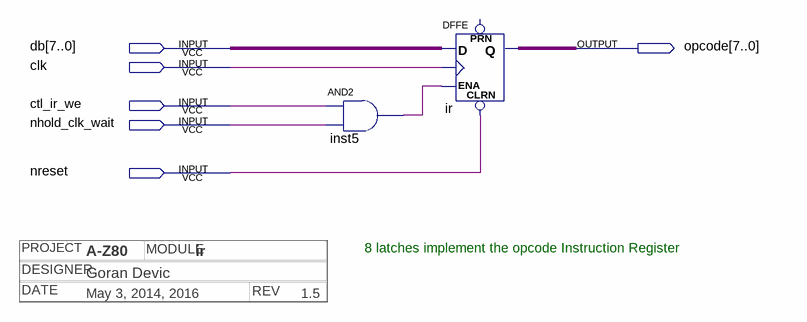
[diagram p0: schematic sheet]
// Quartus schematic ir.bdf as structural Verilog: 2 symbols, 6 pins
// Title block: PROJECT: A-Z80; MODULE: ir; DESIGNER: Goran Devic; DATE: May 3, 2014, 2016; REV: 1.5
module ir (
  input  [7:0] db,
  input  clk,
  input  ctl_ir_we,
  input  nhold_clk_wait,
  input  nreset,
  output [7:0] opcode
);

  wire inst5_out;

  and inst5 (inst5_out, ctl_ir_we, nhold_clk_wait);
  DFFE ir[7:0] (.CLRN(nreset), .D(db), .CLK(clk), .ENA(inst5_out), .Q(opcode));  // open: PRN

  // Notes on the sheet:
  //   8 latches implement the opcode Instruction Register
endmodule
